# EAGLE board XPL-32 (EAGLE 9.6.2), part 1 of 2
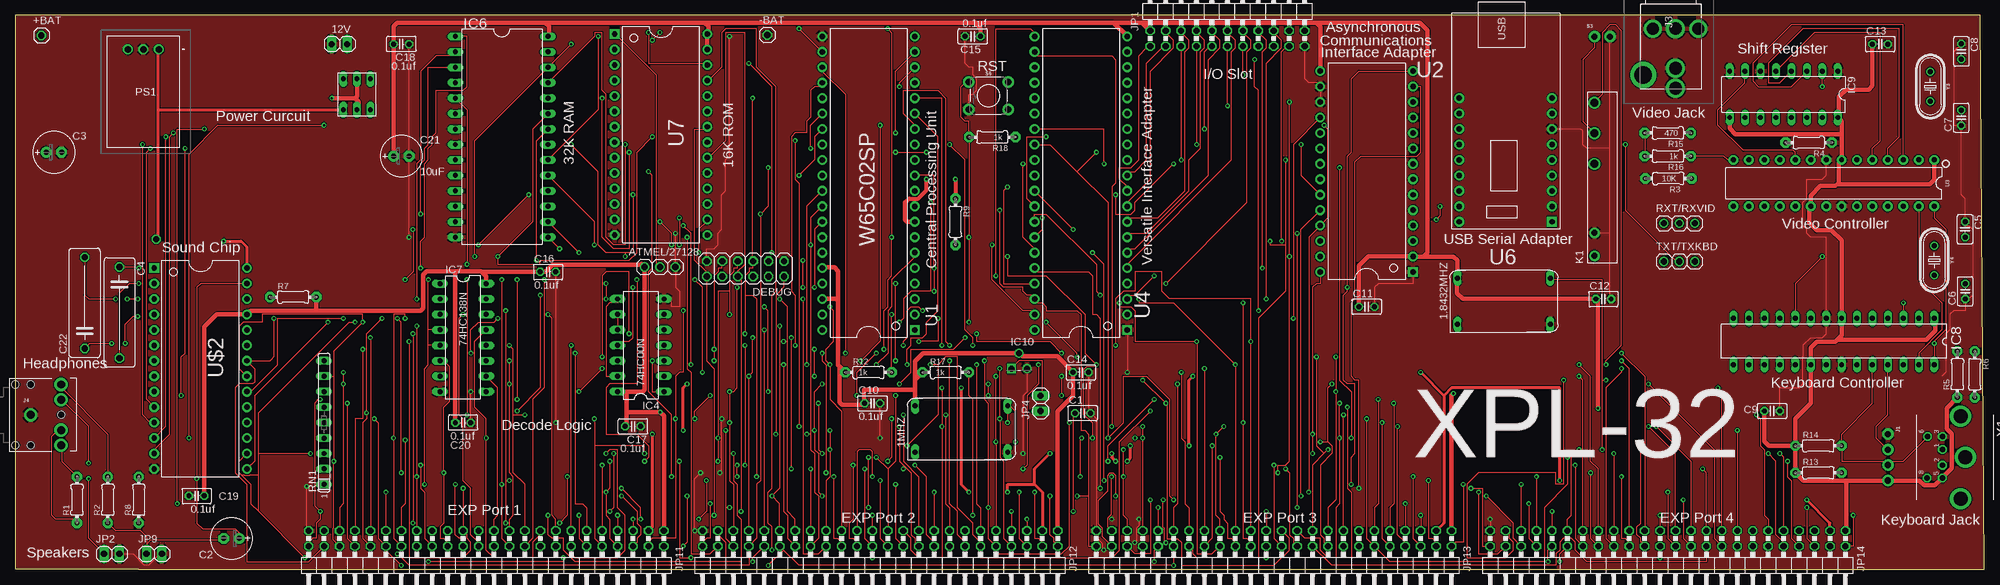
[diagram p1: board, top side]
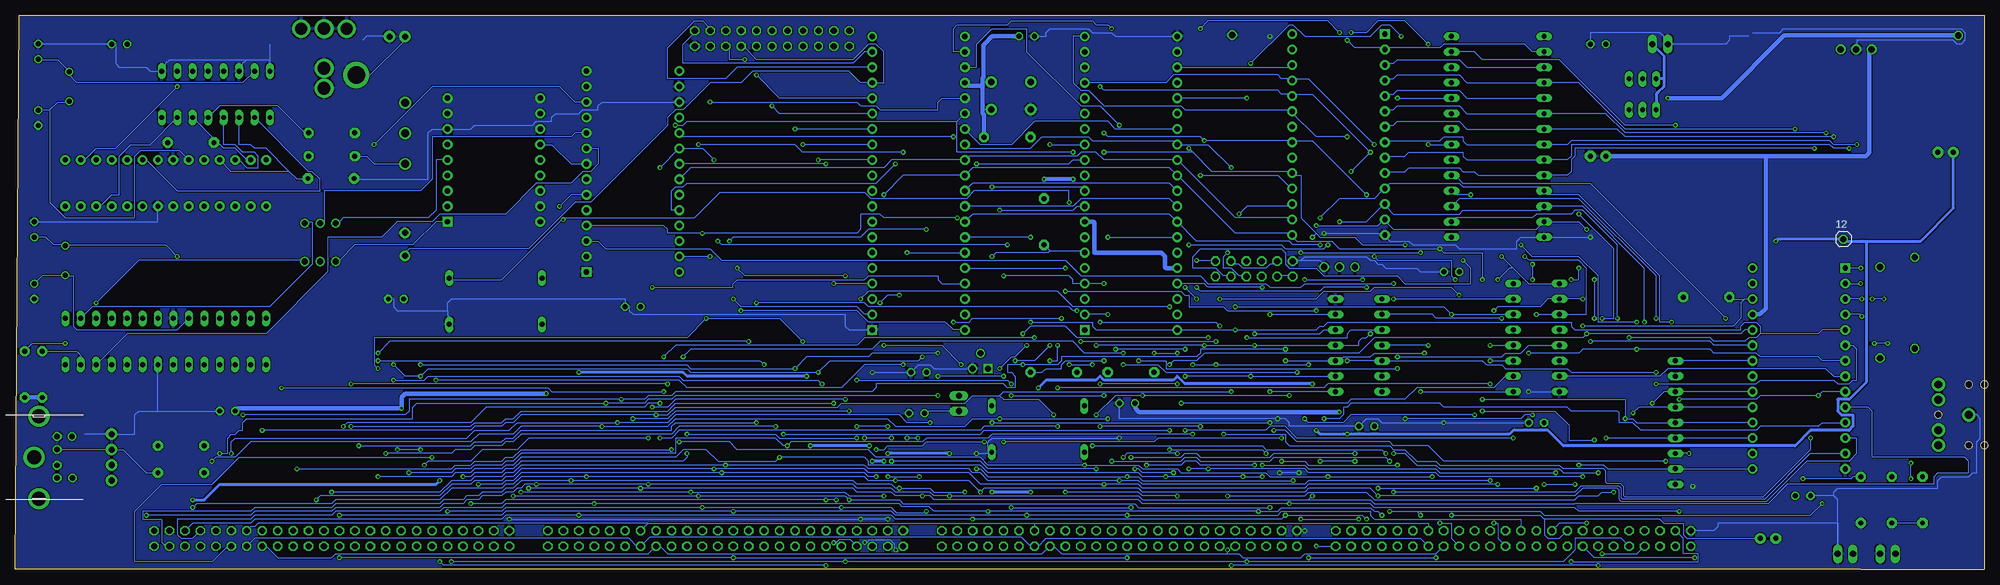
[diagram p2: board, bottom side, seen from below]

Size 323.83 x 91.11 mm. Coordinates in mm from the lower left corner, seen from the top.
Outline: 20.32,0 323.83,0 323.19,91.11 0,91.11 0,0 20.32,0
Copper layers (1*16): Top 0.035mm / dielectric 1.5mm / Bottom 0.035mm
Design rules "default *": minimum track width 6mil, minimum drill 0.35mm, track to track 6mil, track to pad 6mil, pad to pad 6mil, via to via 6mil, smd to smd 6mil, copper to edge 6mil, drill to drill 6mil, minimum pad ring 10mil, minimum via ring 8mil, stop-mask expansion 4mil, vias tented up to drill 0mil, thermal gap 10mil

## Footprints (pad centres in the part's own frame; a part is rotated, then mirrored left to right if it is on the bottom)
OSCCAN = drill 0.813 long: 1 -7.62,-3.81; 7 7.62,-3.81; 8 7.62,3.81; 14 -7.62,3.81
1X01 = drill 1.016 octagon: 1 0,0
1X02 = drill 1.016 long: 1 -1.27,0; 2 1.27,0
1X03 = drill 1.016: 1 -2.54,0; 2 0,0; 3 2.54,0
C025-025X050 = drill 0.813 octagon: 1 -1.27,0; 2 1.27,0
E2,5-7 = drill 0.813 pad 1.778: + -1.27,0 | drill 0.813 pad 1.778 octagon: - 1.27,0
C150-054X183 = drill 1.016 octagon: 1 -7.493,0; 2 7.493,0
2X06 = drill 1.016 octagon: 1 -6.35,-1.27; 2 -6.35,1.27; 3 -3.81,-1.27; 4 -3.81,1.27; 5 -1.27,-1.27; 6 -1.27,1.27; 7 1.27,-1.27; 8 1.27,1.27; 9 3.81,-1.27; 10 3.81,1.27; 11 6.35,-1.27; 12 6.35,1.27
DIL14 = drill 0.813 long: 1 -7.62,-3.81; 2 -5.08,-3.81; 3 -2.54,-3.81; 4 0,-3.81; 5 2.54,-3.81; 6 5.08,-3.81; 7 7.62,-3.81; 8 7.62,3.81; 9 5.08,3.81; 10 2.54,3.81; 11 0,3.81; 12 -2.54,3.81; 13 -5.08,3.81; 14 -7.62,3.81
DIL28-6 = drill 0.813 long: 1 -16.51,-7.62; 2 -13.97,-7.62; 3 -11.43,-7.62; 4 -8.89,-7.62; 5 -6.35,-7.62; 6 -3.81,-7.62; 7 -1.27,-7.62; 8 1.27,-7.62; 9 3.81,-7.62; 10 6.35,-7.62; 11 8.89,-7.62; 12 11.43,-7.62; 13 13.97,-7.62; 14 16.51,-7.62; 15 16.51,7.62; 16 13.97,7.62; 17 11.43,7.62; 18 8.89,7.62; 19 6.35,7.62; 20 3.81,7.62; 21 1.27,7.62; 22 -1.27,7.62; 23 -3.81,7.62; 24 -6.35,7.62; 25 -8.89,7.62; 26 -11.43,7.62; 27 -13.97,7.62; 28 -16.51,7.62
DIL16 = drill 0.813 long: 1 -8.89,-3.81; 2 -6.35,-3.81; 3 -3.81,-3.81; 4 -1.27,-3.81; 5 1.27,-3.81; 6 3.81,-3.81; 7 6.35,-3.81; 8 8.89,-3.81; 9 8.89,3.81; 10 6.35,3.81; 11 3.81,3.81; 12 1.27,3.81; 13 -1.27,3.81; 14 -3.81,3.81; 15 -6.35,3.81; 16 -8.89,3.81
DIL28-3 = drill 0.813 long: 1 -16.51,-3.81; 2 -13.97,-3.81; 3 -11.43,-3.81; 4 -8.89,-3.81; 5 -6.35,-3.81; 6 -3.81,-3.81; 7 -1.27,-3.81; 8 1.27,-3.81; 9 3.81,-3.81; 10 6.35,-3.81; 11 8.89,-3.81; 12 11.43,-3.81; 13 13.97,-3.81; 14 16.51,-3.81; 15 16.51,3.81; 16 13.97,3.81; 17 11.43,3.81; 18 8.89,3.81; 19 6.35,3.81; 20 3.81,3.81; 21 1.27,3.81; 22 -1.27,3.81; 23 -3.81,3.81; 24 -6.35,3.81; 25 -8.89,3.81; 26 -11.43,3.81; 27 -13.97,3.81; 28 -16.51,3.81
TO127P254X495-3 = drill 0.991 pad 1.486 square: 1 -2.54,-2.54 | drill 0.991 pad 1.486: 2 -1.27,0; 3 0,-2.54
1X04_NO_SILK = drill 1.016 pad 1.88: 1 0,0; 2 2.54,0; 3 5.08,0; 4 7.62,0
973 = drill 2.08 pad 3.12: 1 0,0; 2 6.5,0; 3 9.8,0 | drill 2.87 pad 4.305: 4 7.62,-5.299 | drill 1.98 pad 2.97: 5 0,-3.745; 6 0,3.745
AUDIO-JACK = drill 1.3 pad 2.184: RING 5,5; RSH 5,2.5; SLEEVE 0,0; TIP 5,-5; TSH 5,-2.5 | hole 1.2: 0,5; -2.5,5; -2.5,-5; 0,-5; 5,0
2X11/90 = drill 1.016 octagon: 1 -12.7,-6.35; 2 -12.7,-3.81; 3 -10.16,-6.35; 4 -10.16,-3.81; 5 -7.62,-6.35; 6 -7.62,-3.81; 7 -5.08,-6.35; 8 -5.08,-3.81; 9 -2.54,-6.35; 10 -2.54,-3.81; 11 0,-6.35; 12 0,-3.81; 13 2.54,-6.35; 14 2.54,-3.81; 15 5.08,-6.35; 16 5.08,-3.81; 17 7.62,-6.35; 18 7.62,-3.81; 19 10.16,-6.35; 20 10.16,-3.81; 21 12.7,-6.35; 22 12.7,-3.81
2X24/90 = drill 1.016 octagon: 1 -29.21,-6.35; 2 -29.21,-3.81; 3 -26.67,-6.35; 4 -26.67,-3.81; 5 -24.13,-6.35; 6 -24.13,-3.81; 7 -21.59,-6.35; 8 -21.59,-3.81; 9 -19.05,-6.35; 10 -19.05,-3.81; 11 -16.51,-6.35; 12 -16.51,-3.81; 13 -13.97,-6.35; 14 -13.97,-3.81; 15 -11.43,-6.35; 16 -11.43,-3.81; 17 -8.89,-6.35; 18 -8.89,-3.81; 19 -6.35,-6.35; 20 -6.35,-3.81; 21 -3.81,-6.35; 22 -3.81,-3.81; 23 -1.27,-6.35; 24 -1.27,-3.81; 25 1.27,-6.35; 26 1.27,-3.81; 27 3.81,-6.35; 28 3.81,-3.81; 29 6.35,-6.35; 30 6.35,-3.81; 31 8.89,-6.35; 32 8.89,-3.81; 33 11.43,-6.35; 34 11.43,-3.81; 35 13.97,-6.35; 36 13.97,-3.81; 37 16.51,-6.35; 38 16.51,-3.81; 39 19.05,-6.35; 40 19.05,-3.81; 41 21.59,-6.35; 42 21.59,-3.81; 43 24.13,-6.35; 44 24.13,-3.81; 45 26.67,-6.35; 46 26.67,-3.81; 47 29.21,-6.35; 48 29.21,-3.81
APF30212C = drill 1 pad 1.7: 1 -12.6,0; 2 -8.82,0 | drill 1.3 pad 1.9: COM 7.56,0; NC 2.52,0; NO 12.6,0
OKI78SR515W36HEC = drill 1.067 pad 1.6: 1 0,0; 2 2.54,0; 3 5.08,0
0204/7 = drill 0.813 pad 1.676 octagon: 1 -3.81,0; 2 3.81,0
SIL9 = drill 0.813 long: 1 -10.16,0; 2 -7.62,0; 3 -5.08,0; 4 -2.54,0; 5 0,0; 6 2.54,0; 7 5.08,0; 8 7.62,0; 9 10.16,0
1X02_NO_SILK = drill 1.016 pad 1.88: 1 0,0; 2 2.54,0
TACTILE_SWITCH_PTH_6.0MM = drill 1.016 pad 1.88: 1 -3.251,2.261; 2 3.251,2.261; 3 -3.251,-2.261; 4 3.251,-2.261
DIP-40 = drill 0.889 pad 1.6 square: 1 -22.86,-7.62 | drill 0.889 pad 1.6: 2 -20.32,-7.62; 3 -17.78,-7.62; 4 -15.24,-7.62; 5 -12.7,-7.62; 6 -10.16,-7.62; 7 -7.62,-7.62; 8 -5.08,-7.62; 9 -2.54,-7.62; 10 0,-7.62; 11 2.54,-7.62; 12 5.08,-7.62; 13 7.62,-7.62; 14 10.16,-7.62; 15 12.7,-7.62; 16 15.24,-7.62; 17 17.78,-7.62; 18 20.32,-7.62; 19 22.86,-7.62; 20 25.4,-7.62; 21 25.4,7.62; 22 22.86,7.62; 23 20.32,7.62; 24 17.78,7.62; 25 15.24,7.62; 26 12.7,7.62; 27 10.16,7.62; 28 7.62,7.62; 29 5.08,7.62; 30 2.54,7.62; 31 0,7.62; 32 -2.54,7.62; 33 -5.08,7.62; 34 -7.62,7.62; 35 -10.16,7.62; 36 -12.7,7.62; 37 -15.24,7.62; 38 -17.78,7.62; 39 -20.32,7.62; 40 -22.86,7.62
DIP-28 = drill 0.889 pad 1.6 square: 1 -15.24,-7.62 | drill 0.889 pad 1.6: 2 -12.7,-7.62; 3 -10.16,-7.62; 4 -7.62,-7.62; 5 -5.08,-7.62; 6 -2.54,-7.62; 7 0,-7.62; 8 2.54,-7.62; 9 5.08,-7.62; 10 7.62,-7.62; 11 10.16,-7.62; 12 12.7,-7.62; 13 15.24,-7.62; 14 17.78,-7.62; 15 17.78,7.62; 16 15.24,7.62; 17 12.7,7.62; 18 10.16,7.62; 19 7.62,7.62; 20 5.08,7.62; 21 2.54,7.62; 22 0,7.62; 23 -2.54,7.62; 24 -5.08,7.62; 25 -7.62,7.62; 26 -10.16,7.62; 27 -12.7,7.62; 28 -15.24,7.62
DIP28 = drill 0.813 pad 1.626: 1 -16.51,-3.81; 2 -13.97,-3.81; 3 -11.43,-3.81; 4 -8.89,-3.81; 5 -6.35,-3.81; 6 -3.81,-3.81; 7 -1.27,-3.81; 8 1.27,-3.81; 9 3.81,-3.81; 10 6.35,-3.81; 11 8.89,-3.81; 12 11.43,-3.81; 13 13.97,-3.81; 14 16.51,-3.81; 15 16.51,3.81; 16 13.97,3.81; 17 11.43,3.81; 18 8.89,3.81; 19 6.35,3.81; 20 3.81,3.81; 21 1.27,3.81; 22 -1.27,3.81; 23 -3.81,3.81; 24 -6.35,3.81; 25 -8.89,3.81; 26 -11.43,3.81; 27 -13.97,3.81; 28 -16.51,3.81
FTDI = drill 0.889 pad 1.6 square: 1 -22.86,-7.62 | drill 0.889 pad 1.6: 2 -20.32,-7.62; 3 -17.78,-7.62; 4 -15.24,-7.62; 5 -12.7,-7.62; 6 -10.16,-7.62; 7 -7.62,-7.62; 8 -5.08,-7.62; 9 -2.54,-7.62; 10 -2.54,7.62; 11 -5.08,7.62; 12 -7.62,7.62; 13 -10.16,7.62; 14 -12.7,7.62; 15 -15.24,7.62; 16 -17.78,7.62; 17 -20.32,7.62; 18 -22.86,7.62
TOGGLE_BUTTON = drill 0.813 long: 1 -10.16,-1.27; 2 -7.938,-1.27; 3 -5.715,-1.27; 4 -5.715,3.81; 5 -7.938,3.81; 6 -10.16,3.81
M_DIN6 = drill 0.9 pad 1.422 octagon: 1 -1.3,-3.75; 2 1.3,-3.75; 3 -3.4,-3.75; 5 3.4,-3.75; 6 -3.4,-6.2; 8 3.4,-6.25 | drill 2.3 pad 3.5: SH1 6.8,-0.75; SH2 0,0.05; SH3 -6.75,-0.75
HC49U = drill 0.813: 1 -2.413,0; 2 2.413,0

## Placement (x,y rotation side)
1.8432MHZ  OSC  [OSCCAN]  244.82,44.09 0 top
1MHZ  OSC  [OSCCAN]  155.61,23.08 0 top
12  [1X01]  23.18,54.29 0 bottom
12V  [1X02]  53.34,86.36 0 top
+BAT  [1X01]  4.3,87.78 0 top
-BAT  [1X01]  123.68,87.85 0 top
ATMEL/27128  [1X03]  106.03,49.72 0 top
C1  0.1uf  [C025-025X050]  175.55,25.67 0 top
C2  1UF  [E2,5-7]  35.56,5.08 180 top
C3  10uF  [E2,5-7]  6.35,68.58 0 top
C4  470pF  [C150-054X183]  17.14,42.23 270 top
C5  22pf  [C025-025X050]  320.68,55.91 270 top
C6  22pf  [C025-025X050]  320.7,45.72 90 top
C7  22pf  [C025-025X050]  320.04,74.24 90 top
C8  22pf  [C025-025X050]  320.04,85.14 270 top
C9  0.1uf  [C025-025X050]  288.93,26.03 0 top
C10  0.1uf  [C025-025X050]  140.97,27.3 0 top
C11  0.1uf  [C025-025X050]  222.25,43.18 0 top
C12  0.1uf  [C025-025X050]  261.19,44.45 0 top
C13  0.1uf  [C025-025X050]  306.7,86.36 0 top
C14  0.1uf  [C025-025X050]  175.26,32.38 0 top
C15  0.1uf  [C025-025X050]  157.48,87.63 180 top
C16  0.1uf  [C025-025X050]  87.63,48.89 0 top
C17  0.1uf  [C025-025X050]  101.6,23.49 180 top
C18  0.1uf  [C025-025X050]  63.5,86.36 180 top
C19  0.1uf  [C025-025X050]  29.84,12.06 0 top
C20  0.1uf  [C025-025X050]  73.66,24.13 180 top
C21  10uF  [E2,5-7]  63.5,67.94 0 top
C22  470pF  [C150-054X183]  11.43,43.81 90 top
DEBUG  [2X06]  120.1,49.41 180 top
IC4  74HC00N  [DIL14]  102.87,36.83 90 top
IC6  [DIL28-6]  80.01,71.12 270 top
IC7  74HC138N  [DIL16]  73.66,38.1 270 top
IC8  328P  [DIL28-3]  299.08,37.46 180 top
IC9  74HCT166N  [DIL16]  290.83,78.11 180 top
IC10  MCP120-450DI_TO  [TO127P254X495-3]  166.37,35.56 0 top
J1  [1X04_NO_SILK]  307.98,22.22 270 top
J3  973  [973]  273.05,88.9 270 top
J4  AUDIO_JACK_3.5MM_PTH  [AUDIO-JACK]  2.54,25.4 0 top
JP1  [2X11/90]  199.35,92.35 0 top
JP2  [1X02]  15.88,2.54 0 top
JP4  [1X02]  168.64,27.29 90 top
JP9  [1X02]  22.86,2.54 0 top
JP11  [2X24/90]  77.47,0 180 top
JP12  [2X24/90]  142.24,0 180 top
JP13  [2X24/90]  207.01,0 180 top
JP14  [2X24/90]  271.78,0 180 top
K1  APF30205C  [APF30212C]  259.71,64.14 90 top
PS1  OKI-78SR-5_1.5-W36HE-C  [OKI78SR515W36HEC]  23.6,85.5 180 top
R1  10  [0204/7]  10.16,11.43 90 top
R2  10  [0204/7]  15.24,11.43 90 top
R3  10K  [0204/7]  271.88,64.26 0 top
R4  10K  [0204/7]  294.96,70.17 180 top
R5  4.7K  [0204/7]  319.4,32.07 90 top
R6  4.7K  [0204/7]  322.26,32.07 270 top
R7  470  [0204/7]  45.72,44.77 0 top
R8  1k  [0204/7]  20.32,11.43 90 top
R9  1k  [0204/7]  154.62,57.15 270 top
R12  1k  [0204/7]  140.34,32.38 0 top
R13  10k  [0204/7]  296.55,15.88 0 top
R14  10k  [0204/7]  296.55,20.32 0 top
R15  470  [0204/7]  271.78,71.75 180 top
R16  1k  [0204/7]  271.78,67.94 180 top
R17  1k  [0204/7]  153.03,32.38 0 top
R18  1k  [0204/7]  160.68,71.07 180 top
RN1  1K  [SIL9]  50.8,24.13 90 top
RXT/RXVID  [1X03]  273.67,56.89 0 top
S3  VIDEO  [1X02_NO_SILK]  259.71,87.58 0 top
S6  MOMENTARY-SWITCH-SPST-PTH-6.0MM  [TACTILE_SWITCH_PTH_6.0MM]  160.07,77.88 0 top
TXT/TXKBD  [1X03]  273.67,50.61 0 top
U1  W65C02SP  [DIP-40]  140.34,62.23 90 top
U2  [DIP-28]  222.25,64.14 90 top
U3  328P  [DIP28]  299.08,63.5 180 top
U4  [DIP-40]  175.26,62.23 90 top
U6  FTDI  [FTDI]  245.11,80.01 90 top
U7  AT28C256/27128  [DIP-28]  106.2,72.77 270 top
U$1  TOGGLE_PUSHBUTTON  [TOGGLE_BUTTON]  64.14,76.83 0 top
U$2  6581  [DIP-28]  30.48,34.29 270 top
X1  [M_DIN6]  320.68,18.41 270 top
Y3  16MHz  [HC49U]  314.96,79.38 270 top
Y4  11.0592MHz  [HC49U]  315.6,50.8 270 top

## Tracks (layer width: path | path; a pad name or v marks a point on that pad's centre or on a via)
!8800-8FFF  (via drill 0.35)
  Top 0.203: v87.63,41.91 88.27,41.27 88.27,8.89 88.9,8.25 JP11.15 | JP12.15 153.67,10.16 153.03,10.79 v153.03,25.4 | JP13.15 v218.44,25.4 | v283.21,22.86 JP14.15 | v123.19,43.18 123.83,42.55 v123.83,29.21
  Bottom 0.203: IC7.14 v87.63,41.91 88.9,43.18 v123.19,43.18 | v153.03,25.4 155.57,27.94 161.29,27.94 161.93,28.58 | 161.93,28.58 166.37,28.58 167.64,27.3 187.96,27.3 188.59,26.67 215.26,26.67 216.53,25.4 v218.44,25.4 240.66,25.4 241.94,24.13 243.21,24.13 243.84,23.49 248.28,23.49 248.92,22.86 v283.21,22.86 | v123.83,29.21 161.29,29.21 161.93,28.58
!9000-97FF  (via drill 0.35)
  Top 0.203: JP13.17 215.9,10.16 217.17,11.43 v217.17,29.21 v217.17,34.92 | v280.04,29.84 280.67,29.21 JP14.17 | IC7.13 75.56,37.46 75.56,26.67 77.47,24.77 v77.47,21.59 77.47,3.17 78.74,1.9 85.09,1.9 85.09,4.45 86.36,5.71 JP11.17 | v151.13,12.7 JP12.17 | v132.72,12.06 132.08,12.7 132.08,19.05 131.44,19.68 v131.44,22.86 131.44,29.21 v132.72,30.48 | v156.21,38.1 154.31,36.2 147.32,36.2 147.32,32.38 v145.41,30.48
  Bottom 0.203: v217.17,29.21 235.59,29.21 236.22,29.84 v280.04,29.84 | v151.13,12.7 139.06,12.7 138.43,12.06 v132.72,12.06 | v131.44,22.86 118.11,22.86 117.47,23.49 114.94,23.49 113.03,21.59 v77.47,21.59 | v217.17,34.92 215.26,36.83 185.42,36.83 184.15,38.1 v156.21,38.1 | v132.72,30.48 v145.41,30.48
!9800-9FFF  (via drill 0.35)
  Top 0.203: JP13.19 213.36,17.14 215.26,19.05 | v215.9,19.68 215.26,19.05 | v277.5,16.51 278.13,15.88 JP14.19 | v81.28,36.83 81.92,36.2 81.92,25.4 | 81.92,25.4 81.92,15.88 83.82,13.97 JP11.19 | JP12.19 148.59,15.24 146.05,17.78 v146.05,25.4 | v114.3,28.58 111.76,26.03 v111.76,24.77 | 81.92,25.4 v83.82,25.4 | 215.26,19.05 214,20.32 v214,34.92 | v141.6,35.56 138.43,32.38 v138.43,28.58
  Bottom 0.203: v215.9,19.68 240.66,19.68 241.94,18.41 243.21,18.41 243.84,17.78 248.28,17.78 248.92,17.14 251.46,17.14 252.09,16.51 v277.5,16.51 | v81.28,36.83 IC7.12 | v146.05,25.4 142.88,28.58 v138.43,28.58 v114.3,28.58 | v111.76,24.77 111.12,24.13 105.41,24.13 104.14,25.4 v83.82,25.4 | v214,34.92 212.72,36.2 182.88,36.2 181.61,37.46 149.86,37.46 147.96,35.56 v141.6,35.56
!A000-A7FF  (via drill 0.35)
  Top 0.203: v81.28,34.29 v81.28,30.48 81.28,15.88 81.92,15.24 81.92,8.89 81.28,8.25 JP11.21 | JP12.21 147.32,5.08 147.32,3.17 148.59,1.9 152.4,1.9 v152.4,23.49 v152.4,29.84 | JP13.21 212.09,5.08 214.63,5.08 214.63,3.17 215.9,1.9 217.17,1.9 217.17,10.16 217.81,10.79 v217.81,21.59 v217.81,27.3 | JP14.21 275.59,17.78 v269.88,23.49
  Bottom 0.203: v81.28,34.29 IC7.11 | v152.4,29.84 108.58,29.84 107.95,30.48 v81.28,30.48 | v217.81,21.59 215.9,21.59 214.63,22.86 165.1,22.86 164.47,23.49 v152.4,23.49 | v269.88,23.49 269.24,24.13 248.92,24.13 246.38,26.67 220.34,26.67 219.71,27.3 v217.81,27.3
!A800-AFFF  (via drill 0.35)
  Top 0.203: IC7.10 79.38,29.84 79.38,8.89 78.74,8.25 JP11.23 | 143.51,16.51 JP12.23 | v141.6,18.41 143.51,16.51 | v132.72,19.05 132.08,19.68 v132.08,27.3 | JP13.23 209.55,5.08 209.55,3.17 207.01,0.63 191.77,0.63 191.77,4.45 191.17,5.05 189.42,5.05 189.42,27.12 v189.23,27.3 v185.42,31.12 | v268.61,23.49 273.05,19.05 JP14.23 | 143.51,16.51 144.78,17.78 v144.78,28.58 | v160.02,30.48 v160.02,28.58
  Bottom 0.203: v141.6,18.41 140.97,19.05 v132.72,19.05 | v132.08,27.3 104.78,27.3 104.14,27.94 95.25,27.94 93.34,29.84 80.64,29.84 78.74,31.75 IC7.10 | v189.23,27.3 215.26,27.3 216.53,26.03 240.66,26.03 241.94,24.77 243.21,24.77 243.84,24.13 248.28,24.13 248.92,23.49 v268.61,23.49 | v160.02,28.58 v144.78,28.58 | v160.02,30.48 160.66,31.12 v185.42,31.12
!CSROM  (via drill 0.35)
  Top 0.203: v99.06,8.89 JP11.7 | v119.38,9.52 119.38,47.62 DEBUG.8 118.75,48.26 118.75,48.89 120.02,50.16 120.02,88.27 116.84,88.27 116.84,70.48 114.3,67.94 U7.20 | v163.83,9.52 JP12.7 | v228.6,10.79 JP13.7
  Bottom 0.203: v99.06,8.89 99.69,9.52 100.33,9.52 100.97,10.16 115.57,10.16 116.2,9.52 v119.38,9.52 v163.83,9.52 172.72,9.52 173.51,10.31 177.95,10.31 178.44,10.79 v228.6,10.79 243.21,10.79 243.84,10.16 253.37,10.16 254,9.52 271.14,9.52 271.78,8.89 284.48,8.89 285.12,8.25 297.18,8.25 297.18,5.71 296.55,5.08 294.64,5.08 JP14.7
!IRQ  (via drill 0.35)
  Top 0.203: v144.78,34.29 v144.78,46.99 | U4.21 167.64,88.27 167,88.9 161.29,88.9 v161.29,48.26 | JP12.25 v140.97,8.89 | v205.74,9.52 JP13.25 | v270.51,8.89 JP14.25 | R17.2 156.84,28.58 157.48,27.94 v157.48,8.89
  Bottom 0.203: v144.78,46.99 U1.4 149.86,46.99 149.86,47.62 150.5,48.26 v161.29,48.26 | v144.78,34.29 151.13,34.29 151.76,33.66 151.76,33.02 154.31,33.02 154.94,32.38 R17.2 | JP11.25 76.2,8.25 100.33,8.25 100.97,8.89 100.97,9.52 115.57,9.52 116.2,8.89 v140.97,8.89 v157.48,8.89 179.07,8.89 179.71,9.52 v205.74,9.52 243.21,9.52 243.84,8.89 v270.51,8.89
!NMI  (via drill 0.35)
  Top 0.152: v180.31,15.24 180.31,9.08 179.73,8.51 179.73,6.96 JP13.45 | v175.15,15.24 175.15,21.38 v175.37,21.59 | v177.8,33.66 177.42,33.27 176.16,33.27 175.64,32.75 175.64,25.6 177.17,24.07 v177.17,21.59
  Top 0.203: v67.94,1.27 90.17,1.27 v90.17,1.9 | JP12.45 115.57,5.71 116.84,4.45 116.84,1.9 v111.12,1.9 109.22,1.9 v109.22,17.78 | JP14.45 245.75,5.71 245.75,5.08 246.38,4.45 246.38,3.17 245.11,1.9 238.76,1.9 238.76,13.97 240.66,15.88 253.37,15.88 253.37,13.97 254.63,13.97 v254.63,31.12 | v177.8,33.66 175.9,35.56 175.9,41.91 169.54,48.26 163.19,48.26 v163.19,51.44 | v103.5,17.78 104.14,18.41 104.14,20.32 102.23,22.22 97.16,22.22 97.16,29.84 97.79,30.48 102.23,30.48 v102.23,47.62 | v111.76,47.62 113.03,46.35 v113.03,32.38 | v141.6,33.66 143.51,35.56 143.51,42.55 144.15,43.18 144.15,47.62 147.96,51.44 U1.6
  Bottom 0.152: v180.31,15.24 v175.15,15.24 | v175.37,21.59 v177.16,21.59 v177.17,21.59
  Bottom 0.203: R9.2 153.67,52.39 | U1.6 148.27,52.39 153.67,52.39 | JP11.45 49.53,5.08 49.53,2.54 46.99,2.54 46.99,1.27 v67.94,1.27 | v111.12,1.9 v90.17,1.9 | v254.63,31.12 214.63,31.12 213.36,29.84 187.96,29.84 184.15,33.66 v177.8,33.66 | v163.19,51.44 162.56,52.07 153.99,52.07 153.67,52.39 | v103.5,17.78 v109.22,17.78 | v111.76,47.62 v102.23,47.62 | v113.03,32.38 134.62,32.38 135.89,33.66 v141.6,33.66
!OEROM  (via drill 0.35)
  Top 0.203: v101.6,8.25 JP11.5 | v114.94,8.89 114.94,33.02 113.67,34.29 113.67,47.62 DEBUG.12 113.67,48.26 113.67,48.89 111.76,50.8 111.76,72.39 113.67,72.39 U7.22 | v166.37,8.25 JP12.5 | v231.14,8.89 JP13.5
  Bottom 0.203: v101.6,8.25 102.23,8.89 v114.94,8.89 115.57,8.25 v166.37,8.25 179.07,8.25 179.71,8.89 v231.14,8.89 243.21,8.89 243.84,8.25 284.48,8.25 285.12,7.62 294.64,7.62 JP14.5 | DEBUG.10 116.2,48.26 114.3,48.26 DEBUG.12
!READ  (via drill 0.35)
  Top 0.203: v114.94,34.29 v114.94,36.2 114.94,48.26 115.57,48.89 115.57,49.53 116.2,49.53 116.2,50.16 DEBUG.9 | JP11.11 93.98,10.16 93.34,10.79 92.08,10.79 v92.08,35.56 | JP12.11 158.75,10.16 158.12,10.79 v158.12,33.66 | JP13.11 223.52,10.16 224.16,10.79 v224.16,27.94 | JP14.11 288.29,8.25 287.65,8.89 287.65,19.68 287.02,20.32 287.02,24.77 v286.38,25.4
  Bottom 0.203: v114.94,34.29 IC4.3 106.05,34.29 105.41,34.92 100.97,34.92 100.33,35.56 v92.08,35.56 | DEBUG.3 123.83,50.16 122.56,50.16 121.92,49.53 118.11,49.53 117.47,50.16 116.84,50.16 DEBUG.9 | v114.94,36.2 128.91,36.2 128.91,35.56 129.54,34.92 151.76,34.92 151.76,34.29 152.4,33.66 v158.12,33.66 160.66,33.66 160.66,32.38 160.02,32.38 159.38,31.75 159.38,29.84 160.66,29.84 161.29,30.48 182.25,30.48 182.25,29.84 182.88,29.21 215.26,29.21 215.9,28.58 219.71,28.58 220.34,27.94 v224.16,27.94 259.08,27.94 259.08,26.03 259.71,25.4 v286.38,25.4
!ROM  (via drill 0.35)
  Top 0.203: JP13.9 226.06,10.16 226.69,10.79 v226.69,27.3 | v290.19,19.05 290.83,18.41 JP14.9 | 117.47,45.72 117.47,48.26 118.11,48.89 118.11,49.53 118.75,49.53 118.75,50.16 DEBUG.7 | 117.47,45.72 v117.47,41.91 | v96.52,17.14 JP11.9 | v115.57,17.78 v115.57,21.59 115.57,45.72 117.47,45.72 | JP12.9 v161.29,20.95 v161.29,31.75 | v172.09,31.75 v172.09,28.58
  Bottom 0.203: v290.19,19.05 288.93,19.05 288.93,21.59 288.29,22.22 287.65,22.22 287.02,22.86 286.38,22.86 286.38,24.13 285.75,24.77 258.44,24.77 258.44,26.67 257.81,27.3 v226.69,27.3 220.34,27.3 219.71,27.94 215.9,27.94 215.26,28.58 v172.09,28.58 | v117.47,41.91 IC4.6 | v96.52,17.14 111.12,17.14 111.76,17.78 v115.57,17.78 | v161.29,20.95 136.53,20.95 135.89,21.59 v115.57,21.59 | v161.29,31.75 v172.09,31.75
!RST  (via drill 0.35)
  Top 0.203: v187.96,10.16 JP13.39 | v173.99,9.52 173.99,25.4 C1.1 | v252.73,9.52 JP14.39 | v58.42,38.1 JP11.39 | v123.19,39.37 JP12.39 | v168.91,57.78 168.91,55.88 168.28,55.25 167.64,55.25 U4.34 | S6.1 156.21,80.01 155.57,79.38 155.57,74.3 156.21,73.66 156.84,73.66 156.84,71.12 R18.2 156.84,70.48 v156.84,54.61 v156.84,40.64 | v210.82,55.25 v210.82,10.16
  Bottom 0.203: C1.1 173.99,26.03 168.91,26.03 JP4.1 | v173.99,9.52 174.2,9.31 178.86,9.31 179.71,10.16 v187.96,10.16 v210.82,10.16 243.21,10.16 243.84,9.52 v252.73,9.52 | v58.42,38.1 45.09,38.1 44.45,37.46 39.37,37.46 38.73,38.1 37.47,38.1 36.83,38.73 | 36.83,38.73 27.3,38.73 26.67,39.37 U$2.5 | v156.84,54.61 U4.34 | U2.4 217.17,56.52 216.53,55.88 216.53,55.25 v210.82,55.25 185.42,55.25 184.78,55.88 184.78,58.42 181.61,58.42 180.97,57.78 v168.91,57.78 | v156.84,40.64 146.69,40.64 146.69,40.01 146.05,39.37 U1.40 v123.19,39.37 109.86,39.37 109.22,40.01 108.58,40.01 107.95,40.64 67.94,40.64 67.94,40.01 67.31,39.37 40.01,39.37 40.01,40.01 39.37,40.64 37.47,40.64 36.83,40.01 36.83,38.73
!SERIAL  (via drill 0.35)
  Top 0.203: v97.16,46.99 v97.16,44.45
  Bottom 0.203: v97.16,44.45 IC7.15 | v97.16,46.99 111.76,46.99 112.39,46.35 117.47,46.35 118.11,46.99 127.64,46.99 128.91,48.26 148.59,48.26 151.13,50.8 207.65,50.8 209.55,52.7 226.69,52.7 227.97,53.98 U2.3
!SID
  Bottom 0.203: IC7.7 53.34,31.75 52.07,33.02 26.04,33.02 24.77,31.75 U$2.8
!VIA  (via drill 0.35)
  Top 0.203: v96.52,33.02 v92.71,29.21 | v139.06,34.29 142.24,37.46 v142.24,73.03
  Bottom 0.203: v92.71,29.21 IC7.9 | v96.52,33.02 134.62,33.02 134.62,34.29 v139.06,34.29 | v142.24,73.03 145.41,76.2 148.59,76.2 157.48,85.09 157.48,88.9 163.19,88.9 165.74,86.36 165.74,82.55 U4.23
!WRITE  (via drill 0.35)
  Top 0.203: JP11.13 v91.44,36.83 | v129.54,46.35 v129.54,50.8 | v101.6,46.35 101.6,38.1 100.97,37.46 99.06,37.46 IC4.11
  Bottom 0.203: v91.44,36.83 IC4.11 | v129.54,50.8 127,50.8 DEBUG.1 | v129.54,46.35 128.91,45.72 109.22,45.72 108.58,46.35 v101.6,46.35 | 156.21,7.62 JP12.13 | 219.71,7.62 156.21,7.62 | 219.71,7.62 220.34,6.98 220.34,6.35 JP13.13 | JP14.13 285.12,6.98 284.48,6.98 283.85,7.62 219.71,7.62 | JP11.13 91.44,7.62 156.21,7.62
A0  (via drill 0.35)
  Top 0.203: JP13.48 176.53,3.81 176.53,12.06 | 176.53,12.06 176.53,22.22 175.9,22.86 175.26,22.86 175.26,41.91 174.62,42.55 169.54,42.55 169.54,43.18 168.91,43.81 167.64,43.81 U4.38 167.64,45.09 166.37,45.09 165.74,45.72 165.74,46.35 162.56,46.35 161.93,46.99 v161.93,59.05 | JP11.48 48.26,4.45 48.9,5.08 49.53,5.08 49.53,7.62 50.16,8.25 v50.16,9.52 49.21,10.48 49.21,27.3 49.85,27.94 v50.16,27.94 | JP12.48 113.03,4.45 113.67,5.08 114.3,5.08 v114.3,10.79 | JP14.48 241.3,3.81 241.3,13.34 v239.4,13.34 | U2.13 231.14,79.38 231.14,68.58 230.5,67.94 221.3,67.94 220.34,66.99 220.34,44.45 219.71,43.81 219.71,31.75 220.34,31.12 220.98,31.12 v220.98,13.34 | v27.94,69.22 27.94,35.56 27.3,34.92 v27.3,28.58 | v174.62,12.06 176.53,12.06
  Bottom 0.203: U1.9 149.22,59.69 149.86,59.05 v161.93,59.05 | U7.10 98.42,65.41 95.25,65.41 94.61,66.04 86.36,66.04 85.72,65.41 83.82,65.41 83.19,64.77 IC6.10 68.58,64.77 67.94,65.41 67.94,67.31 67.31,67.94 67.31,69.22 v27.94,69.22 | v50.16,27.94 37.47,27.94 36.83,28.58 v27.3,28.58 26.67,29.21 U$2.9 | v50.16,9.52 66.67,9.52 67.31,10.16 100.33,10.16 100.97,10.79 v114.3,10.79 138.43,10.79 139.06,11.43 172.72,11.43 173.35,12.06 v174.62,12.06 177.44,12.06 | v239.4,13.34 v220.98,13.34 213.36,13.34 209.55,13.34 186.06,13.34 185.42,12.7 179.71,12.7 179.07,12.06 177.44,12.06 | 177.44,12.06
A1  (via drill 0.35)
  Top 0.203: U4.37 162.56,46.99 162.56,62.23 v163.19,62.86 | v109.86,3.81 110.49,4.45 v110.49,12.06 | v170.18,12.06 170.18,5.71 170.81,5.08 170.81,4.45 171.45,4.45 JP12.2 | JP13.2 236.85,4.45 238.12,4.45 v238.12,13.97 | JP14.2 302.26,3.81 v302.26,8.89 | U2.14 220.98,81.92 219.71,80.64 219.71,68.58 219.07,67.94 v219.07,46.35 219.07,45.72 218.44,45.09 218.44,31.12 219.07,30.48 220.34,30.48 220.34,19.05 219.71,18.41 v219.71,13.97 | v22.23,69.22 21.59,68.58 21.59,27.94 U$2.10
  Bottom 0.203: v163.19,62.86 148.59,62.86 U1.10 | U7.9 98.42,67.94 95.25,67.94 94.61,68.58 85.72,68.58 85.72,67.94 85.09,67.31 IC6.9 68.58,67.31 67.94,67.94 67.94,69.85 25.4,69.85 24.77,69.22 v22.23,69.22 | v109.86,3.81 JP11.2 | 111.12,11.43 v110.49,12.06 | 111.12,11.43 138.43,11.43 139.06,12.06 v170.18,12.06 172.72,12.06 173.35,12.7 179.07,12.7 179.71,13.34 185.42,13.34 186.06,13.97 209.55,13.97 213.36,13.97 v219.71,13.97 v238.12,13.97 240.03,13.97 240.66,13.34 241.3,13.34 241.94,12.7 243.21,12.7 243.84,12.06 247.01,12.06 247.65,11.43 249.56,11.43 250.19,10.79 253.37,10.79 254,10.16 271.14,10.16 271.78,9.52 284.48,9.52 285.12,8.89 v302.26,8.89 | 111.12,11.43 100.97,11.43 100.33,10.79 67.31,10.79 35.56,10.79 32.38,13.97 8.26,13.97 8.26,15.24 7.62,15.88 2.54,15.88 2.54,17.78 3.17,18.41 18.41,18.41 18.41,26.03 19.05,26.67 21.46,26.67 U$2.10 | U4.37 171.45,46.99 172.09,47.62 172.09,48.26 183.51,48.26 184.15,47.62 205.1,47.62 205.74,46.99 205.74,46.35 v219.07,46.35
A2  (via drill 0.35)
  Top 0.203: JP11.4 104.14,4.45 104.78,5.08 108.58,5.08 v108.58,24.77 108.58,31.75 109.22,32.38 109.86,32.38 v109.86,42.55 | v20.95,69.85 20.95,25.4 22.23,24.13 U$2.11 | JP12.4 168.91,4.45 168.28,5.08 167.64,5.08 v167.64,12.7 | v178.44,13.34 178.44,41.27 177.8,41.91 177.16,41.91 177.16,48.26 176.53,48.89 167.64,48.89 U4.36 | JP13.4 233.68,4.45 233.04,5.08 232.41,5.08 v232.41,14.61 | U1.11 151.13,64.77 v151.13,49.53 v151.13,45.72
  Bottom 0.203: U7.8 98.42,70.48 89.53,70.48 88.9,71.12 85.72,71.12 85.72,70.48 85.09,69.85 IC6.8 68.58,69.85 67.94,70.48 25.4,70.48 24.77,69.85 v20.95,69.85 | v108.58,24.77 106.05,24.77 105.41,25.4 105.41,26.67 104.78,26.67 104.14,27.3 89.53,27.3 88.9,26.67 68.58,26.67 67.94,26.03 60.33,26.03 60.01,25.72 60.01,24.13 57.78,24.13 56.52,22.86 38.73,22.86 37.47,22.86 36.83,23.49 27.3,23.49 26.67,24.13 U$2.11 | v167.64,12.7 172.72,12.7 173.35,13.34 v178.44,13.34 179.07,13.34 179.71,13.97 185.42,13.97 186.06,14.61 209.55,14.61 213.36,14.61 v232.41,14.61 240.66,14.61 241.94,13.34 243.21,13.34 243.84,12.7 247.01,12.7 247.65,12.06 249.56,12.06 250.19,11.43 253.37,11.43 254,10.79 271.14,10.79 271.78,10.16 284.48,10.16 285.12,9.52 302.89,9.52 302.89,8.25 299.72,8.25 299.72,4.45 299.08,3.81 JP14.4 | U4.36 v151.13,49.53 | v109.86,42.55 124.46,42.55 125.09,43.18 130.81,43.18 130.81,45.09 131.44,45.09 132.08,45.72 v151.13,45.72
A3  (via drill 0.35)
  Top 0.203: v165.74,66.67 165.74,54.61 167.64,52.7 U4.35 | JP11.6 102.23,4.45 102.23,5.08 102.87,5.71 102.87,6.98 102.23,7.62 102.23,9.52 v99.69,12.06 | JP12.6 165.1,5.08 v165.1,12.7 | JP13.6 229.87,5.08 v229.87,15.24 | JP14.6 294.64,5.08 v294.64,10.16 | v24.77,71.12 24.77,23.49 U$2.12 | v177.16,52.07 179.07,50.16 v179.07,14.61
  Bottom 0.203: U1.12 149.86,67.31 150.5,66.67 v165.74,66.67 | U7.7 98.42,73.03 97.16,73.03 96.52,73.66 86.36,73.66 85.09,72.39 IC6.7 60.33,72.39 59.05,71.12 v24.77,71.12 | v294.64,10.16 294,10.79 271.78,10.79 271.14,11.43 254,11.43 252.09,13.34 243.84,13.34 243.21,13.97 241.94,13.97 240.66,15.24 v229.87,15.24 213.36,15.24 209.55,15.24 184.15,15.24 183.51,14.61 v179.07,14.61 167,14.61 v165.1,12.7 164.47,13.34 139.06,13.34 138.43,12.7 111.76,12.7 111.12,13.34 100.97,13.34 v99.69,12.06 67.31,12.06 66.04,13.34 60.33,13.34 60.01,13.02 60.01,11.43 59.73,11.15 35.84,11.15 29.21,17.78 22.23,17.78 20.95,19.05 20.95,21.59 U$2.12 | v177.16,52.07 U4.35
A4  (via drill 0.35)
  Top 0.203: JP11.8 97.79,5.08 97.79,8.25 97.16,8.89 v97.16,12.7 97.79,13.34 v97.79,17.78 | v26.04,71.75 25.4,71.12 25.4,22.22 23.02,19.84 | 22.86,19.68 23.02,19.84 | JP12.8 162.56,5.08 162.56,17.78 161.93,18.41 v161.93,24.77 v161.93,33.02 | v227.33,23.49 227.33,5.71 228.6,4.45 JP13.8 | JP14.8 292.1,5.08 292.1,14.61 291.46,15.24 v291.46,17.78 | v153.67,69.85 156.21,67.31 156.21,39.37 157.48,38.1 v157.48,36.83 | v143.51,17.78 144.15,18.41 v144.15,24.77 | U$2.13 22.86,19.68 | 22.86,19.68 23.02,19.84
  Bottom 0.203: U7.6 98.42,75.56 97.16,75.56 96.52,76.2 86.36,76.2 85.09,74.93 IC6.6 62.23,74.93 59.05,71.75 v26.04,71.75 | v97.16,12.7 67.31,12.7 66.36,13.65 66.22,13.65 66.19,13.69 60.05,13.69 59.69,13.34 59.69,13.2 59.65,13.16 59.65,11.75 59.41,11.51 36.12,11.51 28.57,19.05 U$2.13 | v291.46,17.78 290.83,18.41 287.65,18.41 285.12,20.95 248.92,20.95 247.65,22.22 241.94,22.22 240.66,23.49 v227.33,23.49 216.53,23.49 215.26,24.77 180.34,24.77 179.07,23.49 167.64,23.49 166.37,24.77 v161.93,24.77 v144.15,24.77 | v153.67,69.85 U1.13 | v157.48,36.83 159.38,34.92 160.02,34.92 v161.93,33.02 | v97.79,17.78 98.42,18.41 116.84,18.41 117.47,17.78 128.91,17.78 129.54,18.41 131.44,18.41 132.08,17.78 v143.51,17.78
A5  (via drill 0.35)
  Top 0.203: JP11.10 95.25,5.08 95.25,20.32 | v95.25,24.77 95.25,20.32 | v74.3,47.62 v74.3,25.4 | v74.3,50.16 74.3,75.56 IC6.5 | JP13.10 224.79,5.08 v224.79,24.13 | v288.29,19.05 289.56,17.78 289.56,5.71 290.83,4.45 JP14.10 | v159.38,34.29 159.38,27.94 160.02,27.3 v160.02,10.16 160.02,5.08 JP12.10 161.29,2.54 172.09,2.54 173.35,3.81 v173.35,24.13 | v153.67,36.83 153.03,37.46 153.03,77.47 151.76,78.74 146.05,78.74 146.05,74.93 147.96,73.03 U1.14 | 95.25,20.32 103.5,20.32 v103.5,19.05 | v140.34,10.16 v140.34,18.41
  Bottom 0.203: IC6.5 85.09,77.47 86.36,78.74 96.52,78.74 97.16,78.11 98.42,78.11 U7.5 | v95.25,24.77 76.2,24.77 75.56,25.4 v74.3,25.4 | v74.3,50.16 v74.3,47.62 | v288.29,19.05 288.29,20.95 287.65,21.59 249.56,21.59 248.28,22.86 242.57,22.86 241.3,24.13 v224.79,24.13 216.53,24.13 215.26,25.4 178.44,25.4 177.16,24.13 v173.35,24.13 | v159.38,34.29 156.21,34.29 v153.67,36.83 | v103.5,19.05 116.84,19.05 117.47,18.41 128.91,18.41 129.54,19.05 131.44,19.05 132.08,18.41 v140.34,18.41 | v160.02,10.16 v140.34,10.16
A6  (via drill 0.35)
  Top 0.203: v255.27,18.41 255.27,13.97 251.46,10.16 251.46,1.27 226.06,1.27 JP13.12 222.25,5.08 v222.25,24.77 | JP11.12 92.71,5.08 v92.71,8.89 | v97.79,9.52 98.42,10.16 v98.42,19.05 | v146.69,20.32 151.76,25.4 151.76,33.66 | 151.76,33.66 153.03,34.92 154.94,34.92 154.94,10.16 157.48,7.62 157.48,5.71 158.75,4.45 JP12.12 158.75,1.9 180.34,1.9 181.61,3.17 181.61,20.95 v186.69,26.03 | U1.15 151.76,71.12 151.76,42.55 149.86,40.64 149.86,38.73 149.22,38.1 147.32,38.1 147.32,36.83 146.69,36.2 v146.69,33.66 | 151.76,33.66 v150.5,33.66 | v31.11,72.39 26.67,72.39 v26.67,10.79
  Bottom 0.203: v255.27,18.41 287.02,18.41 291.46,13.97 299.72,13.97 304.17,9.52 304.17,1.27 291.46,1.27 288.93,3.81 JP14.12 | U7.4 98.42,80.64 97.16,80.64 96.52,81.28 86.36,81.28 85.09,80.01 IC6.4 66.67,80.01 59.05,72.39 v31.11,72.39 | 93.34,9.52 v92.71,8.89 | v97.79,9.52 93.34,9.52 | v98.42,19.05 99.06,19.68 118.11,19.68 118.75,20.32 v146.69,20.32 | v150.5,33.66 v146.69,33.66 | v26.67,10.79 28.57,8.89 72.39,8.89 73.03,9.52 93.34,9.52 | v222.25,24.77 216.53,24.77 215.26,26.03 v186.69,26.03
A7  (via drill 0.35)
  Top 0.203: U1.16 152.4,77.47 v152.4,36.83 | v153.67,34.29 153.67,10.79 154.94,9.52 154.94,5.71 156.21,4.45 JP12.14 | IC6.3 67.94,82.55 67.94,69.85 67.31,69.22 67.31,67.31 66.67,66.67 v66.67,58.42 | v62.87,41.27 63.5,40.64 v63.5,15.88 | v97.16,19.05 97.79,19.68 99.06,19.68 99.06,10.16 100.33,8.89 100.33,3.17 99.06,1.9 92.08,1.9 91.44,2.54 JP11.14
  Bottom 0.203: IC6.3 85.09,82.55 86.36,83.82 96.52,83.82 97.16,83.19 98.42,83.19 U7.3 | JP11.14 92.71,5.08 154.31,5.08 155.57,3.81 JP12.14 156.84,3.81 158.35,5.31 179.18,5.31 | 179.18,5.31 219.48,5.31 JP13.14 221.62,3.81 222.88,5.08 284.48,5.08 JP14.14 | v152.4,36.83 152.4,34.29 v153.67,34.29 | v66.67,58.42 60.96,52.7 60.96,41.27 v62.87,41.27 | v63.5,15.88 69.22,15.88 69.85,16.51 89.53,16.51 90.17,17.14 93.34,17.14 95.25,19.05 v97.16,19.05 | 179.18,5.31
A8  (via drill 0.35)
  Top 0.203: IC6.25 95.25,87.63 95.25,88.27 96.52,88.27 96.52,78.74 97.16,78.11 97.16,54.61 98.42,53.34 100.33,53.34 v100.33,69.85 | v124.46,3.17 124.46,6.98 123.83,7.62 123.83,12.7 124.46,13.34 124.46,45.09 125.09,45.72 125.09,79.38 121.92,82.55 121.92,88.9 116.84,88.9 116.2,88.27 116.2,82.55 114.3,80.64 U7.25
  Bottom 0.203: v100.33,69.85 111.12,80.64 113.67,80.64 U7.25 114.3,80.64 115.57,80.64 116.2,81.28 133.35,81.28 134.62,80.01 U1.17 | JP11.16 90.17,2.54 111.76,2.54 112.39,1.9 121.92,1.9 122.56,2.54 124.46,2.54 | 124.46,2.54 151.76,2.54 153.03,3.81 JP12.16 154.94,2.54 216.53,2.54 217.81,3.81 JP13.16 219.71,2.54 271.14,2.54 271.78,1.9 280.67,1.9 282.57,3.81 JP14.16 | 124.46,2.54 v124.46,3.17
A9  (via drill 0.35)
  Top 0.203: v96.52,77.47 96.52,54.61 98.42,52.7 100.97,52.7 v100.97,68.58 | U1.18 145.41,80.01 v145.41,79.38 | v89.53,7.62 90.81,8.89 v90.81,15.24 | v147.96,17.14 149.86,15.24 149.86,5.71 151.13,4.45 JP12.18 | JP13.18 215.26,4.45 215.26,5.08 214.63,5.71 214.63,17.14 216.53,19.05 216.53,20.32 215.9,20.95 | v214.63,20.95 215.9,20.95 | JP14.18 279.4,5.08 279.4,19.68 v268.61,30.48 | v216.53,30.48 215.9,29.84 215.9,20.95 | v104.14,65.41 104.78,64.77 104.78,49.53 104.14,48.89 104.14,29.21 107.95,25.4 v107.95,15.24
  Bottom 0.203: v96.52,77.47 IC6.24 | v145.41,79.38 144.78,78.74 116.2,78.74 115.57,78.11 114.3,78.11 U7.24 113.67,78.11 110.49,78.11 v100.97,68.58 v104.14,65.41 | JP11.18 87.63,5.08 87.63,7.62 v89.53,7.62 | v90.81,15.24 v107.95,15.24 117.47,15.24 118.11,15.88 132.08,15.88 132.72,16.51 138.43,16.51 139.06,17.14 v147.96,17.14 163.83,17.14 165.1,18.41 182.25,18.41 183.51,19.68 205.1,19.68 206.38,20.95 v214.63,20.95 | v216.53,30.48 v268.61,30.48
A10  (via drill 0.35)
  Top 0.203: JP13.20 216.53,0.63 219.71,0.63 | 219.71,0.63 253.37,0.63 253.37,2.54 254,3.17 254,4.45 254.63,5.08 255.91,5.08 256.54,4.45 256.54,3.17 258.44,1.27 278.13,1.27 JP14.20 | v91.44,69.85 95.89,65.41 95.89,53.34 97.16,52.07 100.33,52.07 | 100.33,52.07 101.6,52.07 v101.6,61.59 | JP11.20 85.09,5.08 85.09,27.94 87,29.84 v87,47.62 | 100.33,52.07 v100.33,51.44 | JP12.20 147.96,4.45 147.96,5.08 147.32,5.71 147.32,15.88 146.05,17.14 | 146.05,17.14 145.41,17.78 v145.41,23.49 | v128.91,23.49 128.91,63.5 128.27,64.14 v128.27,70.48 | U1.19 144.78,81.92 v144.78,71.75 | 219.71,0.63 219.71,12.7 219.07,13.34 v219.07,26.67 | v187.32,27.94 179.71,20.32 v179.71,17.78 | 146.05,17.14 v146.05,16.51
  Bottom 0.203: v91.44,69.85 IC6.21 | v101.6,61.59 110.49,70.48 113.67,70.48 U7.21 114.3,70.48 v128.27,70.48 128.91,71.12 144.15,71.12 v144.78,71.75 | v87,47.62 87.63,48.26 87.63,50.8 99.69,50.8 v100.33,51.44 | v128.91,23.49 v145.41,23.49 | v219.07,26.67 216.53,26.67 215.26,27.94 v187.32,27.94 | v179.71,17.78 165.1,17.78 163.83,16.51 v146.05,16.51
A11  (via drill 0.35)
  Top 0.203: IC6.23 85.09,72.39 85.09,57.15 v79.38,51.44 79.38,50.16 86.36,50.16 86.36,50.8 100.97,50.8 102.23,52.07 102.23,68.58 v104.78,71.12 | JP11.22 80.01,5.08 v80.01,13.97 v80.01,47.62 | JP12.22 144.78,5.08 v144.78,13.97 | JP13.22 210.19,4.45 210.19,5.08 209.55,5.71 209.55,15.88 v208.91,16.51 | JP14.22 274.32,5.08 v274.32,11.43
  Bottom 0.203: U1.20 149.86,87.63 149.86,80.01 148.59,78.74 147.32,78.74 144.78,76.2 132.08,76.2 131.44,75.56 114.3,75.56 U7.23 113.67,74.93 109.86,71.12 v104.78,71.12 | IC7.1 74.93,46.99 77.47,49.53 | v79.38,51.44 77.47,49.53 | v80.01,47.62 78.11,49.53 77.47,49.53 | v80.01,13.97 111.12,13.97 111.76,13.34 138.43,13.34 139.06,13.97 v144.78,13.97 165.1,13.97 167,15.88 183.51,15.88 184.15,16.51 v208.91,16.51 213.36,16.51 240.66,16.51 241.94,15.24 243.21,15.24 243.84,14.61 248.28,14.61 248.92,13.97 252.09,13.97 254,12.06 273.69,12.06 v274.32,11.43
A12  (via drill 0.35)
  Top 0.203: v66.04,44.45 66.04,66.67 66.67,67.31 66.67,81.92 69.22,84.45 72.39,84.45 IC6.2 | v80.64,42.55 80.64,14.61 | 80.64,14.61 v80.64,7.62 | JP12.24 142.24,5.08 v142.24,14.61 | 80.64,14.61 v81.28,14.61 | JP13.24 207.01,5.08 v207.01,17.14 | JP14.24 271.78,5.08 v271.78,12.7 | v128.91,88.9 U1.22 | v104.78,87 v106.05,88.27
  Bottom 0.203: v66.04,44.45 IC7.2 71.75,44.45 73.03,43.18 80.01,43.18 v80.64,42.55 | JP11.24 80.01,5.08 80.01,7.62 v80.64,7.62 | v81.28,14.61 111.12,14.61 111.76,13.97 138.43,13.97 139.06,14.61 v142.24,14.61 163.83,14.61 165.1,15.88 166.37,15.88 167,16.51 183.51,16.51 184.15,17.14 v207.01,17.14 208.91,17.14 213.36,17.14 240.66,17.14 241.94,15.88 243.21,15.88 243.84,15.24 248.28,15.24 248.92,14.61 252.09,14.61 254,12.7 v271.78,12.7 | IC6.2 74.3,85.09 75.56,86.36 88.9,86.36 89.53,85.72 98.42,85.72 U7.2 99.06,85.72 103.5,85.72 v104.78,87 | v128.91,88.9 127.64,90.17 107.95,90.17 v106.05,88.27
A13  (via drill 0.35)
  Top 0.203: v140.97,1.9 JP12.26 139.7,5.08 v139.7,16.51 | JP13.26 v205.74,1.9 | v270.51,1.9 JP14.26 | v73.66,41.91 73.03,41.27 73.03,25.4 73.66,24.77 73.66,14.61 74.93,13.34 74.93,5.71 76.2,4.45 JP11.26 | v75.56,51.44 75.56,70.48 IC6.26 v91.44,86.36 | v104.14,88.27 104.14,83.19 113.67,83.19 U7.26 | v133.35,15.88 133.35,33.66 132.72,34.29 v132.72,35.56 | v136.53,35.56 136.53,78.11 132.72,81.92 U1.23
  Bottom 0.203: v140.97,1.9 v205.74,1.9 v270.51,1.9 | U1.23 114.3,82.55 U7.26 | v73.66,41.91 IC7.3 65.41,41.91 65.41,49.53 66.67,50.8 74.93,50.8 v75.56,51.44 | v104.14,88.27 101.6,88.27 99.69,90.17 95.25,90.17 v91.44,86.36 | v139.7,16.51 139.06,16.51 138.43,15.88 v133.35,15.88 | v136.53,35.56 v132.72,35.56
A14  (via drill 0.35)
  Top 0.203: v67.31,13.97 67.31,33.02 67.94,33.66 67.94,34.29 67.94,36.83 | v72.39,13.97 72.39,5.71 73.03,5.08 73.66,5.08 JP11.28 | IC6.1 74.3,87.63 74.3,79.38 73.66,78.74 69.22,78.74 69.22,71.75 68.58,71.12 68.58,69.85 67.94,69.22 67.94,67.31 67.31,66.67 67.31,54.61 66.67,53.98 v66.67,49.53 | 67.94,36.83 67.94,39.37 | 67.94,39.37 v67.94,47.62 | JP13.28 203.2,4.45 202.56,5.08 201.93,5.08 v201.93,24.13 v201.93,43.81 | v267.33,20.32 267.33,7.62 266.7,6.98 266.7,5.71 267.33,5.08 267.33,4.45 267.97,4.45 JP14.28 | v128.27,36.83 128.27,45.09 127.64,45.72 127.64,71.12 128.27,71.75 130.18,71.75 130.18,73.66 130.81,74.3 130.81,78.74 131.44,79.38 132.72,79.38 U1.24 | JP12.28 138.43,4.45 137.79,5.08 137.16,5.08 137.16,7.62 137.79,8.25 v137.79,17.14 | v120.02,36.83 v120.02,17.14 | v149.22,42.55 148.59,43.18 147.32,43.18 146.69,42.55 146.69,38.1 146.05,37.46 v146.05,36.83 | v96.52,34.92 96.52,48.26 97.16,48.89 100.97,48.89 v100.97,38.73 | IC7.5 67.94,36.83 | IC7.4 67.94,39.37
  Bottom 0.203: v72.39,13.97 v67.31,13.97 | v66.67,49.53 66.67,47.62 v67.94,47.62 | v201.93,24.13 215.26,24.13 215.9,23.49 215.9,22.86 240.66,22.86 241.94,21.59 243.21,21.59 243.84,20.95 248.28,20.95 248.92,20.32 v267.33,20.32 | v137.79,17.14 132.08,17.14 131.44,17.78 129.54,17.78 128.91,17.14 v120.02,17.14 | v201.93,43.81 184.15,43.81 183.51,43.18 150.5,43.18 149.86,42.55 v149.22,42.55 | v146.05,36.83 v128.27,36.83 v120.02,36.83 IC4.4 102.87,36.83 102.87,37.46 102.23,38.1 101.6,38.1 v100.97,38.73 | v96.52,34.92 79.38,34.92 78.74,35.56 76.2,35.56 74.93,36.83 IC7.5
A15  (via drill 0.35)
  Top 0.203: JP11.30 71.12,4.45 70.48,5.08 69.85,5.08 69.85,6.98 70.48,7.62 v70.48,15.88 70.48,26.67 71.44,27.62 71.44,33.34 70.48,34.29 IC7.6 | 120.02,45.09 120.02,48.26 120.65,48.89 120.65,49.53 121.28,49.53 121.28,50.16 DEBUG.5 121.28,50.8 v121.28,77.47 | 120.02,45.09 v120.02,38.73 | JP12.30 135.89,4.45 135.25,5.08 134.62,5.08 v134.62,15.24 | v121.92,15.24 121.92,44.45 121.28,45.09 120.02,45.09 | JP13.30 200.66,4.45 200.03,5.08 199.39,5.08 199.39,7.62 198.75,8.25 198.75,8.89 198.12,9.52 v198.12,18.41 | JP14.30 265.43,4.45 264.8,5.08 264.16,5.08 v264.16,15.24 | v118.75,15.24 v118.75,17.14
  Bottom 0.203: IC4.5 108.58,39.37 109.22,38.73 v120.02,38.73 | v264.16,15.24 252.09,15.24 251.46,15.88 248.92,15.88 248.28,16.51 243.84,16.51 243.21,17.14 241.94,17.14 240.66,18.41 215.26,18.41 214,19.68 210.19,19.68 208.28,17.78 198.75,17.78 v198.12,18.41 184.15,18.41 183.51,17.78 183.51,17.14 165.1,17.14 163.83,15.88 139.06,15.88 138.43,15.24 v134.62,15.24 v121.92,15.24 v118.75,15.24 | v121.28,77.47 U1.25 | v70.48,15.88 89.53,15.88 90.17,16.51 111.12,16.51 111.76,17.14 v118.75,17.14
AUDIO  (via drill 0.35)
  Top 0.203: JP12.31 133.35,14.61 133.99,15.24 v133.99,19.68 v133.99,22.86 | JP13.31 198.12,8.25 197.49,8.89 v197.49,22.22 v198.75,23.49 | v262.89,19.05 JP14.31 | v87.63,8.89 87.63,5.71 88.27,5.08 90.17,5.08 90.17,3.17 92.08,1.27 119.38,1.27 119.38,8.25 118.75,8.89 118.75,13.97 118.11,14.61 v118.11,19.05 | U$2.27 30.48,46.99 29.84,46.35 v29.84,14.92 29.84,7.62 30.8,6.67 36.2,6.67 36.83,6.03 C2.+
  Bottom 0.203: JP11.31 69.85,5.08 71.75,5.08 72.39,5.71 72.39,8.25 | 72.39,8.25 53.34,8.25 52.7,7.62 49.53,7.62 49.53,5.71 48.9,5.08 C2.+ | v133.99,22.86 164.47,22.86 165.1,22.22 v197.49,22.22 | v262.89,19.05 252.09,19.05 251.46,19.68 248.92,19.68 248.28,20.32 243.84,20.32 243.21,20.95 241.94,20.95 240.66,22.22 215.9,22.22 214.63,23.49 v198.75,23.49 | 72.39,8.25 73.03,8.89 v87.63,8.89 | v118.11,19.05 118.75,19.68 v133.99,19.68 | R8.2 21.59,15.24 21.91,14.92 v29.84,14.92
CA1  (via drill 0.35)
  Top 0.203: v203.84,83.82 203.84,79.38 204.47,78.74 v204.47,42.55
  Bottom 0.203: v203.84,83.82 206.38,83.82 206.38,85.72 JP1.17 | v204.47,42.55 185.42,42.55 183.51,40.64 170.81,40.64 169.54,39.37 U4.40
CA2  (via drill 0.35)
  Top 0.203: v208.28,53.98 208.28,85.09 208.91,85.72 JP1.19 | v160.66,53.34 160.66,47.62 165.74,42.55 167.64,42.55 U4.39
  Bottom 0.203: v208.28,53.98 207.65,53.34 v160.66,53.34
CB1
  Bottom 0.203: U4.18 205.1,82.55 207.01,80.64 216.53,80.64 216.53,85.72 212.09,90.17 210.82,90.17 209.55,88.9 JP1.20
CB2
  Bottom 0.203: U4.19 184.15,85.09 186.06,83.19 214,83.19 214,86.36 212.09,88.27 JP1.22
CLK  (via drill 0.35)
  Top 0.203: IC4.1 104.78,29.21 v104.78,34.29 | JP11.43 53.34,10.16 53.98,10.79 v53.98,30.48 v53.98,32.38 | JP12.43 118.11,13.97 117.47,14.61 v117.47,24.13 v117.47,29.21 118.11,29.21 118.75,29.84 v118.75,46.35 | v164.47,20.95 164.47,26.03 163.83,26.67 1MHZ.8 163.19,26.67 v163.19,24.13 | v182.25,19.68 v182.25,15.24 182.25,8.89 182.88,8.25 JP13.43 | v247.65,13.97 JP14.43 | v207.65,15.88 207.65,17.14 208.91,17.14 209.55,17.78 v209.55,51.44 v209.55,76.83
  Bottom 0.203: v104.78,34.29 IC4.12 82.55,34.29 81.92,33.66 79.38,33.66 78.74,33.02 68.58,33.02 67.94,32.38 v53.98,32.38 | IC4.1 v117.47,29.21 | v53.98,30.48 39.37,30.48 37.47,30.48 36.83,31.12 24.77,31.12 24.13,30.48 22.23,30.48 21.59,31.12 20.95,31.12 20.95,36.2 21.59,36.83 U$2.6 | U1.37 128.27,46.99 127.64,46.35 v118.75,46.35 | v164.47,20.95 173.99,20.95 174.62,20.32 180.34,20.32 180.97,19.68 v182.25,19.68 | v247.65,13.97 243.84,13.97 243.21,14.61 241.94,14.61 240.66,15.88 213.36,15.88 209.55,15.88 v207.65,15.88 184.15,15.88 183.51,15.24 v182.25,15.24 | v209.55,51.44 U2.27 | U4.25 171.45,77.47 172.09,76.83 172.09,75.56 181.61,75.56 182.25,76.2 184.78,76.2 185.42,76.83 v209.55,76.83 | v163.19,24.13 v117.47,24.13
D0  (via drill 0.35)
  Top 0.203: JP13.32 196.85,2.54 194.31,2.54 v194.31,37.46 184.15,37.46 184.15,42.55 183.51,43.18 181.61,43.18 v181.61,43.81 | v210.19,41.27 210.19,69.85 U2.18 | JP14.32 261.62,5.08 261.62,29.84 264.16,32.38 v264.16,33.02 | JP12.32 132.08,2.54 129.54,2.54 v129.54,44.45 | v131.44,46.35 131.44,55.88 U1.33 | JP11.32 67.31,5.08 67.31,12.7 66.67,13.34 v66.67,17.14 | v51.44,40.64 39.37,28.58 39.37,17.78 U$2.15 | v109.22,57.78 v109.22,53.34 | v178.44,45.09 177.8,45.72 177.8,50.16 169.54,58.42 167.64,58.42 U4.33
  Bottom 0.203: v194.31,37.46 198.12,41.27 v210.19,41.27 213.36,38.1 264.8,38.1 264.8,33.66 v264.16,33.02 | v131.44,46.35 v129.54,44.45 | U4.33 166.37,58.42 133.99,58.42 U1.33 129.54,53.98 114.3,53.98 113.67,53.34 v109.22,53.34 | v66.67,17.14 62.55,17.14 61.91,16.51 RN1.2 38.73,16.51 U$2.15 | v51.44,40.64 53.34,40.64 53.34,48.26 66.67,61.59 71.75,61.59 IC6.11 73.03,62.86 85.72,62.86 86.36,63.5 97.79,63.5 98.42,62.86 U7.11 99.06,62.23 100.33,60.96 106.05,60.96 v109.22,57.78 | v181.61,43.81 180.34,45.09 v178.44,45.09
D1  (via drill 0.35)
  Top 0.203: 40.01,9.52 38.73,10.79 38.73,13.97 37.15,15.56 | 40.01,9.52 v47.62,1.9 | 37.15,15.56 36.83,15.88 36.83,17.78 U$2.16 | v55.88,40.64 54.93,40.64 40.01,25.72 40.01,19.05 | 40.01,9.52 40.01,15.56 | 40.01,15.56 40.01,19.05 | JP12.34 132.08,5.08 132.08,12.06 131.44,12.7 131.44,19.05 130.81,19.68 130.81,22.22 | 130.81,22.22 v130.81,53.34 130.81,57.78 U1.32 | JP13.34 196.85,5.08 v196.85,20.32 | 130.81,22.22 v130.18,22.22 | JP14.34 259.08,5.08 v259.08,15.88 | v169.54,71.12 166.37,71.12 166.37,60.96 U4.32 | v106.05,57.15 107.95,55.25 v107.95,53.34 | 37.15,15.56 37.56,15.56 37.66,15.46 38.54,15.46 38.64,15.56 40.01,15.56 | 40.01,19.05 v48.58,19.05
  Bottom 0.203: JP11.34 64.14,1.9 v47.62,1.9 | v55.88,40.64 55.88,49.53 66.04,59.69 IC6.12 73.03,59.05 85.72,59.05 86.36,58.42 97.16,58.42 98.42,59.69 U7.12 99.06,59.69 101.6,57.15 v106.05,57.15 | v130.18,22.22 163.19,22.22 163.83,21.59 173.99,21.59 174.62,20.95 196.22,20.95 v196.85,20.32 197.49,20.32 198.75,21.59 215.26,21.59 215.26,19.05 240.66,19.05 241.94,17.78 243.21,17.78 243.84,17.14 248.28,17.14 248.92,16.51 251.46,16.51 252.09,15.88 v259.08,15.88 | U4.32 149.86,59.69 148.59,60.96 133.99,60.96 U1.32 | U2.19 214,71.12 v169.54,71.12 | v107.95,53.34 108.58,52.7 114.94,52.7 115.57,53.34 v130.81,53.34 | v48.58,19.05 RN1.3
D2  (via drill 0.35)
  Top 0.203: JP13.36 193.68,3.17 193.68,2.54 194.31,1.9 204.47,1.9 204.47,41.27 208.91,45.72 208.91,53.34 | v208.91,67.31 208.91,53.34 | JP14.36 256.54,5.08 v256.54,17.14 | v219.71,21.59 219.71,29.21 217.81,31.12 v217.81,66.04 | JP11.36 62.23,5.08 v62.23,21.59 62.23,41.91 64.14,41.91 v64.14,41.27 | JP12.36 127,5.08 127,8.89 126.36,9.52 v126.36,33.66 | v130.18,33.66 130.18,59.69 U1.31 | v109.86,56.52 111.12,55.25 v111.12,33.66 | v64.14,47.62 65.41,48.89 v65.41,55.88 | 208.91,53.34 206.38,53.34 v206.38,53.98 | U4.31 v173.99,55.88
  Bottom 0.203: v208.91,67.31 210.82,69.22 U2.20 v217.81,66.04 | v256.54,17.14 255.91,17.78 248.92,17.78 247.01,19.68 241.3,19.68 239.4,21.59 v219.71,21.59 | v62.23,21.59 52.7,21.59 51.12,21.59 | v130.18,33.66 v126.36,33.66 v111.12,33.66 | U4.31 166.37,63.5 133.99,63.5 U1.31 | v109.86,56.52 99.69,56.52 99.06,57.15 U7.13 98.42,57.15 97.16,55.88 73.66,55.88 IC6.13 66.67,57.15 v65.41,55.88 | v64.14,47.62 v64.14,41.27 | v206.38,53.98 205.74,54.61 184.78,54.61 183.51,55.88 v173.99,55.88 | RN1.4 51.12,21.59 | U$2.17 51.12,21.59
D3  (via drill 0.35)
  Top 0.203: 126.36,3.17 128.91,0.63 v190.5,0.63 JP13.38 | 126.36,3.17 JP12.38 | JP14.38 254,2.54 v254,1.27 | v59.05,24.77 59.69,24.13 59.69,5.08 JP11.38 60.96,3.17 v63.5,0.63 | v89.53,52.7 IC6.15 | v190.5,66.67 184.15,60.33 184.15,59.05 183.51,58.42 180.97,58.42 v180.97,61.59 | v82.55,47.62 v82.55,27.94 | v123.83,0.63 126.36,3.17
  Bottom 0.203: v254,1.27 253.37,0.63 v190.5,0.63 | 51.12,24.13 57.15,24.13 57.78,24.77 v59.05,24.77 59.05,27.94 v82.55,27.94 | 51.12,24.13 RN1.5 | v190.5,66.67 U2.21 | v180.97,61.59 177.8,64.77 U4.30 166.37,66.04 133.99,66.04 U1.30 123.19,55.25 114.3,55.25 U7.15 113.67,54.61 113.03,53.98 107.31,53.98 106.05,52.7 v89.53,52.7 88.9,52.07 82.55,52.07 v82.55,47.62 | v63.5,0.63 v123.83,0.63 | U$2.18 51.12,24.13
D4  (via drill 0.35)
  Top 0.203: v92.71,52.07 IC6.16 | v112.39,52.07 112.39,55.88 113.67,57.15 U7.16 | JP11.40 57.15,5.08 57.15,24.13 57.78,24.77 v57.78,25.72 57.78,38.73 v60.33,41.27 | JP12.40 121.28,1.9 v121.28,1.27 | JP13.40 187.32,3.17 v187.32,1.27 | JP14.40 252.09,3.17 v252.09,1.27
  Bottom 0.203: v112.39,52.07 v92.71,52.07 | U7.16 114.3,57.78 123.19,57.78 U1.29 144.78,67.31 146.05,68.58 148.59,68.58 149.22,67.94 167,67.94 U4.29 179.71,67.31 180.97,66.04 212.72,66.04 U2.22 | v57.78,25.72 56.83,26.67 RN1.6 U$2.19 | JP11.40 59.69,5.08 67.31,5.08 67.31,3.17 69.22,1.27 v121.28,1.27 v187.32,1.27 v252.09,1.27 | IC6.16 87,57.78 74.3,57.78 73.66,58.42 67.94,58.42 67.31,59.05 66.04,59.05 60.33,53.34 v60.33,41.27
D5  (via drill 0.35)
  Top 0.203: v53.98,41.27 43.18,41.27 43.18,33.66 38.73,29.21 U$2.20 | JP11.42 54.61,5.08 v54.61,27.3 | 174.62,65.41 170.18,69.85 U4.28 | 174.62,65.41 179.71,60.33 v179.71,21.59 182.25,24.13 182.25,31.75 186.06,31.75 189.87,27.94 189.87,12.06 v190.5,11.43 | JP14.42 248.92,5.08 v248.92,10.79 | U2.23 211.46,64.77 v211.46,69.85 | 174.62,65.41 v177.8,68.58 | v123.83,66.04 123.83,59.69 v122.56,58.42 122.56,14.61 121.92,13.97 121.92,5.08 JP12.42 120.65,0.63 64.77,0.63 v62.87,2.54 | v188.79,11.43 188.79,6.96 188.98,6.77 188.98,4.62 v189.23,4.37
  Bottom 0.203: IC6.17 86.36,60.96 66.67,60.96 53.98,48.26 v53.98,41.27 | v54.61,27.3 52.7,29.21 RN1.7 U$2.20 | v122.56,58.42 121.28,59.69 114.3,59.69 U7.17 | v179.71,21.59 v184.15,21.59 | v248.92,10.79 243.84,10.79 243.21,11.43 v190.5,11.43 v188.79,11.43 | v211.46,69.85 195.58,69.85 194.31,68.58 v177.8,68.58 | U4.28 167,69.22 156.84,69.22 154.94,71.12 147.32,71.12 146.69,70.48 133.35,70.48 U1.28 127.64,69.85 v123.83,66.04 | JP11.42 57.15,2.54 v62.87,2.54 | v189.23,4.37 188.84,4.37 188.38,4.83 186.44,4.83 JP13.42
D6  (via drill 0.35)
  Top 0.203: v76.2,53.34 v84.45,61.59 | 52.39,31.75 52.39,35.88 v57.15,40.64 57.15,41.91 40.64,41.91 40.64,40.64 37.47,40.64 36.83,40.01 36.83,33.02 U$2.21 | 52.39,31.75 v52.39,17.78 52.39,6.83 52.32,6.77 52.32,4.83 JP11.44 | JP12.44 116.84,5.08 116.84,10.16 | v116.84,22.86 116.84,10.16 | v128.91,64.77 131.44,67.31 131.44,71.12 U1.27 | JP13.44 184.15,2.54 186.69,2.54 v186.69,11.43 | v241.94,12.06 246.38,7.62 246.38,5.08 JP14.44 | U2.24 211.46,55.88 v211.46,12.06 | U4.27 179.07,72.39 v179.07,66.67 | v117.47,10.16 116.84,10.16 | RN1.8 52.39,31.75
  Bottom 0.203: IC6.18 87,61.59 v84.45,61.59 | v76.2,53.34 74.3,51.44 66.67,51.44 63.5,48.26 63.5,40.64 v57.15,40.64 | v116.84,22.86 114.94,22.86 113.03,20.95 97.79,20.95 97.16,20.32 91.44,20.32 88.9,17.78 v52.39,17.78 | v128.91,64.77 116.2,64.77 114.3,62.86 U7.18 | U4.27 165.1,69.85 160.02,69.85 156.21,73.66 144.15,73.66 142.88,72.39 U1.27 | v241.94,12.06 v211.46,12.06 187.32,12.06 v186.69,11.43 178.44,11.43 177.8,10.79 139.7,10.79 139.06,10.16 v117.47,10.16 | v179.07,66.67 182.25,63.5 213.36,63.5 214,62.86 215.26,62.86 215.9,62.23 215.9,59.05 U2.24
D7  (via drill 0.35)
  Top 0.152: 179.07,5.08 178.79,5.36 178.79,6.76 178.13,7.42 178.13,11.38 179.7,12.95 179.7,15.49 180.05,15.84 180.56,15.84 180.91,15.49 180.91,12.13 v180.97,12.06
  Top 0.203: JP13.46 179.07,5.08 | v212.72,12.7 212.72,54.61 U2.25 215.9,57.78 215.9,72.39 v215.26,73.03 | JP14.46 243.84,2.54 240.66,2.54 v240.66,12.7 | JP11.46 48.26,1.27 38.1,1.27 38.1,13.97 36.2,15.88 36.2,29.84 36.83,30.48 39.05,30.48 39.37,30.8 39.37,33.02 U$2.22 41.91,34.29 | IC6.19 95.25,57.15 v95.25,53.34 | JP12.46 114.3,2.54 111.12,2.54 111.12,32.38 110.49,33.02 v110.49,54.61 | U1.26 130.81,73.03 v130.81,69.22 | 42.07,34.45 42.55,34.92 v42.55,41.27 | 42.07,34.45 41.91,34.29 | v144.78,68.58 v149.86,68.58 | 41.91,34.29 42.07,34.45
  Bottom 0.203: v180.97,12.06 186.69,12.06 187.32,12.7 v212.72,12.7 v240.66,12.7 | 168.91,73.66 U4.26 | 168.91,73.66 213.36,73.66 214,73.03 v215.26,73.03 | v95.25,53.34 102.23,53.34 103.5,54.61 109.22,54.61 109.86,55.25 | 109.86,55.25 112.39,57.78 112.39,64.77 113.67,64.77 U7.19 114.3,65.41 127,65.41 130.18,68.58 | 109.86,55.25 v110.49,54.61 | 130.18,68.58 v130.81,69.22 | v42.55,41.27 64.77,63.5 85.72,63.5 87,64.77 IC6.19 | 168.91,73.66 168.91,68.58 v149.86,68.58 | 130.18,68.58 v144.78,68.58 | U$2.22 RN1.9
EXTSND  (via drill 0.35)